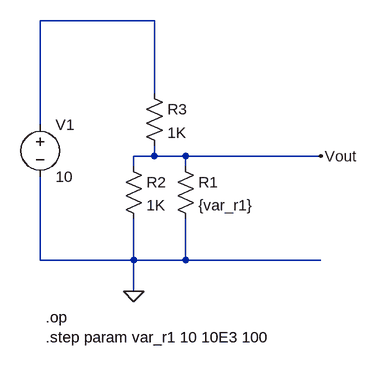
[diagram p0: schematic VoltageDivider.asc]
VoltageDivider.asc, the LTspice schematic file:
Version 4
SHEET 1 880 680
WIRE 160 -16 -16 -16
WIRE 160 96 160 -16
WIRE -16 144 -16 -16
WIRE 160 192 160 176
WIRE 160 192 128 192
WIRE 208 192 160 192
WIRE 416 192 208 192
WIRE 128 208 128 192
WIRE 208 208 208 192
WIRE -16 352 -16 224
WIRE 128 352 128 288
WIRE 128 352 -16 352
WIRE 208 352 208 288
WIRE 208 352 128 352
WIRE 416 352 208 352
WIRE 128 400 128 352
FLAG 128 400 0
FLAG 416 192 Vout
SYMBOL res 192 192 R0
SYMATTR InstName R1
SYMATTR Value {var_r1}
SYMBOL res 112 192 R0
SYMATTR InstName R2
SYMATTR Value 1K
SYMBOL res 144 80 R0
SYMATTR InstName R3
SYMATTR Value 1K
SYMBOL voltage -16 128 R0
WINDOW 123 0 0 Left 0
WINDOW 39 0 0 Left 0
SYMATTR InstName V1
SYMATTR Value 10
TEXT -8 440 Left 2 !.op\n.step param var_r1 10 10E3 100

The netlist it stands for:
* VoltageDivider.asc
R1 Vout 0 {var_r1}
R2 Vout 0 1K
R3 N001 Vout 1K
V1 N001 0 10
.op
.step param var_r1 10 10E3 100
.backanno
.end

* Results of the author's LTspice run, read from the files saved beside the schematic
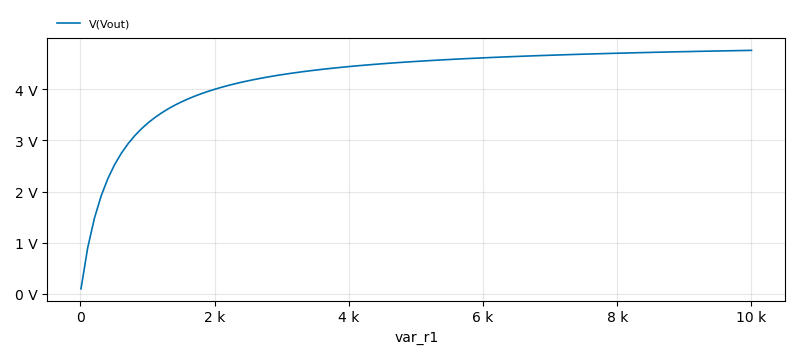
[diagram p1: Operating Point of VoltageDivider.asc, plotted from the saved traces]
* Operating Point, 1 run:
*   V(Vout): 98.04 mV at var_r1=10 , 4.762 V at var_r1=10 k, min 98.04 mV, max 4.762 V